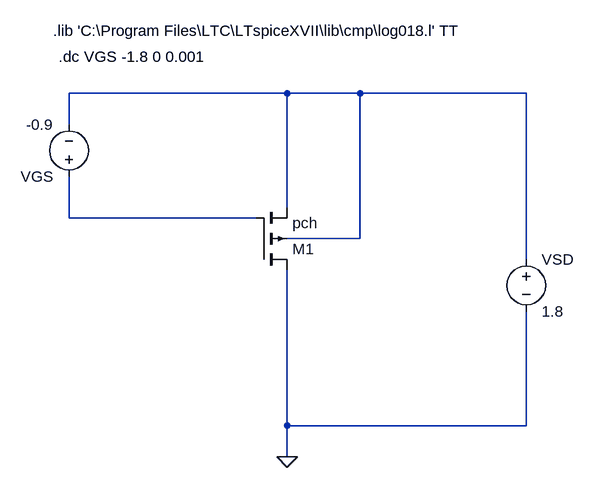
[diagram p0: schematic pmos-testbench.asc]
pmos-testbench.asc, the LTspice schematic file:
Version 4
SHEET 1 880 788
WIRE 48 128 -288 128
WIRE 160 128 48 128
WIRE 416 128 160 128
WIRE -288 176 -288 128
WIRE 48 304 48 128
WIRE -288 320 -288 256
WIRE 0 320 -288 320
WIRE 160 352 160 128
WIRE 160 352 48 352
WIRE 416 384 416 128
WIRE 48 640 48 400
WIRE 416 640 416 464
WIRE 416 640 48 640
WIRE 48 688 48 640
FLAG 48 688 0
SYMBOL pmos4 0 400 M180
SYMATTR InstName M1
SYMATTR Value pch
SYMATTR Value2 l=1u w=3u
SYMBOL voltage -288 272 R180
WINDOW 123 0 0 Left 0
WINDOW 39 0 0 Left 0
SYMATTR InstName VGS
SYMATTR Value -0.9
SYMBOL voltage 416 368 R0
WINDOW 123 0 0 Left 0
WINDOW 39 0 0 Left 0
SYMATTR InstName VSD
SYMATTR Value 1.8
TEXT -312 32 Left 2 !.lib 'C:\\Program Files\\LTC\\LTspiceXVII\\lib\\cmp\\log018.l' TT
TEXT -304 72 Left 2 !.dc VGS -1.8 0 0.001

The netlist it stands for:
* pmos-testbench.asc
M1 0 N002 N001 N001 pch l=1u w=3u
VGS N002 N001 -0.9
VSD N001 0 1.8
.model NMOS NMOS
.model PMOS PMOS
.lib standard.mos
.lib 'C:\Program Files\LTC\LTspiceXVII\lib\cmp\log018.l' TT
.dc VGS -1.8 0 0.001
.backanno
.end

* Results of the author's LTspice run, read from the files saved beside the schematic
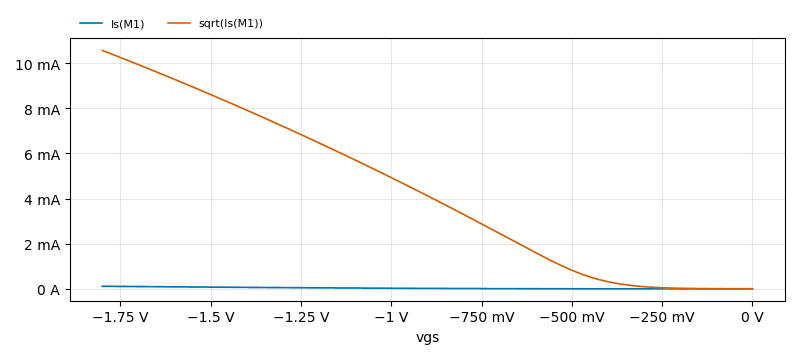
[diagram p1: DC transfer characteristic of pmos-testbench.asc, plotted from the saved traces]
* DC transfer characteristic, 1 run:
*   Is(M1): 111.6 µA at vgs=-1.8 V, 960.2 fA at vgs=0 V, min 960.2 fA, max 111.6 µA
*   sqrt(Is(M1)): 10.56 mA at vgs=-1.8 V, 979.9 nA at vgs=0 V, min 979.9 nA, max 10.56 mA